# Altium project Gastroscopy-LED.PrjPcb
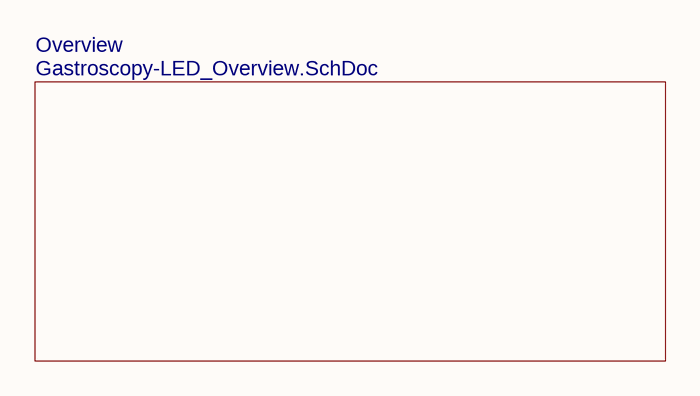
[diagram p0: Gastroscopy-LED_Title.SchDoc]
GlobalAddress1: nab. reki Karpovki, d. 5/3E; GlobalAddress2: Saint-Petersburg, 197022; GlobalAddress3: Ph: +7 (911) 701-51-99; GlobalCompanyName: MRobot, LCC; GlobalDocumentNumberDrawingASM: 0000-0000; GlobalDocumentNumberDrawingPCB: 0000-0000; GlobalDocumentNumberPCB: 0000-0000; GlobalDocumentNumberSCH: 0000-0000; GlobalDocumentSubtitle: Gastroscopy LED; GlobalDocumentTitle: Gastroscopy LED; GlobalEngineer: Podlesnyi Vasilii; GlobalJiraKey: GSTRLED; GlobalProjectTitle: Gastroscopy LED; GlobalRevisionBOM: 0.1.0; GlobalRevisionPCB: 0.1.0; GlobalRevisionSCH: 0.1.0
3 sheets, 8 parts. Net scope: hierarchical (ports join the sheet entries above them; power ports are global).
Board file: Gastroscopy-LED.PcbDoc
Sheets:
  Gastroscopy-LED_Title.SchDoc
    Overview = Gastroscopy-LED_Overview.SchDoc
      LED = Gastroscopy-LED.SchDoc

## Sheet Gastroscopy-LED_Title.SchDoc: not used
size 215 x 279 mm; PageSetup: Record=PageOptions|CenterHorizontal=True|CenterVertical=True|PrintScale=0.94|XCorrection=1.00|YCorrection=1.00|PrintKind=0|BorderSize=5000000|LeftOffset=0|BottomOffset=0|Orientation=2|PaperLength=1000|PaperWidth=1000|Scale=100|PaperSource=15|PrintQuality=600|MediaType=1|DitherType=10|PrintScaleMode=1|PaperKind=Letter|PaperIndex=1; VersionControl_RevNumber: not used; IsUserConfigurable: not used; Date: not used; ApprovedBy: not used; CheckedBy: not used; Author: not used; CompanyName: MRobot, LCC; DrawnBy: not used; Engineer: not used; Organization: not used; Address1: not used; Address2: not used; Address3: not used; Address4: not used; DocumentNumber: 0000-0000; Revision: not used; SheetNumber: 1; SheetTotal: 3; DocumentTitle: Gastroscopy LED; DocumentSubtitle: Gastroscopy LED; ProjectTitle: Gastroscopy LED; JiraKey: GSTRLED; Time: not used; ImagePath: not used; Application_BuildNumber: not used

### Sub-sheets
Overview = Gastroscopy-LED_Overview.SchDoc: no entries

### Notes on the sheet
- Company:
- Project:
- Jira Key:

## Sheet Gastroscopy-LED_Overview.SchDoc: Overview
size 279 x 215 mm; Date: not used; ApprovedBy: not used; CheckedBy: not used; Author: not used; CompanyName: MRobot, LCC; DrawnBy: not used; Engineer: Podlesnyi Vasilii; Organization: not used; Address1: nab. reki Karpovki, d. 5/3E; Address2: Saint-Petersburg, 197022; Address3: Ph: +7 (911) 701-51-99; Address4: not used; DocumentNumber: 0000-0000; Revision: 0.1.0; SheetNumber: 2; SheetTotal: 3; ProjectTitle: Gastroscopy LED; Time: not used; ImagePath: not used; Application_BuildNumber: not used
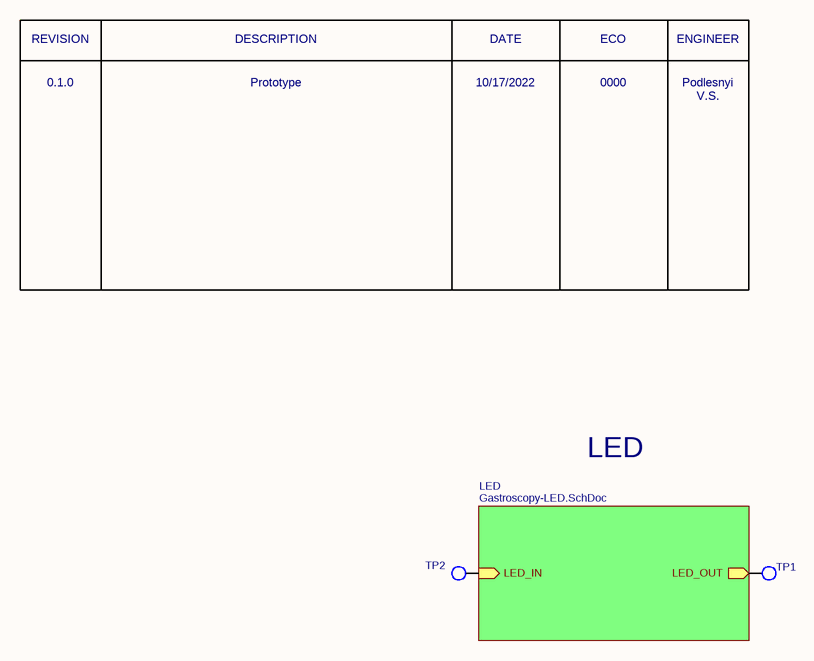
[diagram p1: Gastroscopy-LED_Overview.SchDoc]

### Parts
TP1  TEST_POINT_SMT  [TEST_POINT_SMT]  (value not drawn)  (no BOM)
TP2  TEST_POINT_SMT  [TEST_POINT_SMT]  (value not drawn)  (no BOM)

### Sub-sheets
LED = Gastroscopy-LED.SchDoc: LED_IN (in), LED_OUT (out)

### Nets
NetD1_2: TP2.1 ; sheet LED/LED_IN
NetD6_1: TP1.1 ; sheet LED/LED_OUT

### Notes on the sheet
- REVISION
- DESCRIPTION
- DATE
- ECO
- ENGINEER
- 0.1.0
- Prototype
- 10/17/2022
- 0000
- Podlesnyi V.S.
- LED
- Title:
- Date:
- Size A
- Project:
- Number:
- Time:
- Sheet
- Revision
- of
- Engineer:
- www.mrobots.ru <http://mrobots.ru/>
- File:

### Library data of the parts
TP1 TP2 = TEST_POINT_SMT: STM TEST POINT

## Sheet Gastroscopy-LED.SchDoc: LED
size 279 x 215 mm; Date: not used; ApprovedBy: not used; CheckedBy: not used; Author: not used; CompanyName: MRobot, LCC; DrawnBy: not used; Engineer: Podlesnyi Vasilii; Organization: not used; Address1: nab. reki Karpovki, d. 5/3E; Address2: Saint-Petersburg, 197022; Address3: Ph: +7 (911) 701-51-99; Address4: not used; DocumentNumber: 0000-0000; Revision: 0.1.0; SheetNumber: 3; SheetTotal: 3; ProjectTitle: Gastroscopy LED; Time: not used; ImagePath: not used; Application_BuildNumber: not used
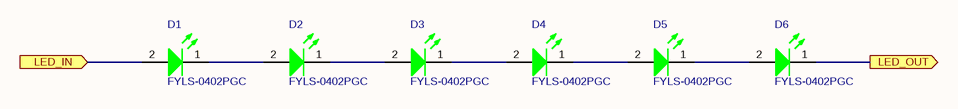
[diagram p2: Gastroscopy-LED.SchDoc]

### Parts
D1  FYLS-0402PGC  [L_0402_GREEN]
D2  FYLS-0402PGC  [L_0402_GREEN]
D3  FYLS-0402PGC  [L_0402_GREEN]
D4  FYLS-0402PGC  [L_0402_GREEN]
D5  FYLS-0402PGC  [L_0402_GREEN]
D6  FYLS-0402PGC  [L_0402_GREEN]

### Ports
LED_IN (in), LED_OUT (out)

### Nets
NetD1_1: D1.1(K) D2.2(A)
NetD1_2: D1.2(A) ; port LED_IN
NetD2_1: D2.1(K) D3.2(A)
NetD3_1: D3.1(K) D4.2(A)
NetD4_1: D4.1(K) D5.2(A)
NetD5_1: D5.1(K) D6.2(A)
NetD6_1: D6.1(K) ; port LED_OUT

### Notes on the sheet
- Title:
- Date:
- Size A
- Project:
- Number:
- Time:
- Sheet
- Revision
- of
- Engineer:
- www.mrobots.ru <http://mrobots.ru/>
- File:

### Library data of the parts
D1-D6 = FYLS-0402PGC: LED GREEN CLEAR SMD; Manufacturer 1: Ningbo Foryard Optoelectronics; Manufacturer Part Number 1: FYLS-0402PGC

## Nets that join several sheets
NetD1_2: Gastroscopy-LED_Overview (TP2.1), Gastroscopy-LED (D1.2)
NetD6_1: Gastroscopy-LED_Overview (TP1.1), Gastroscopy-LED (D6.1)